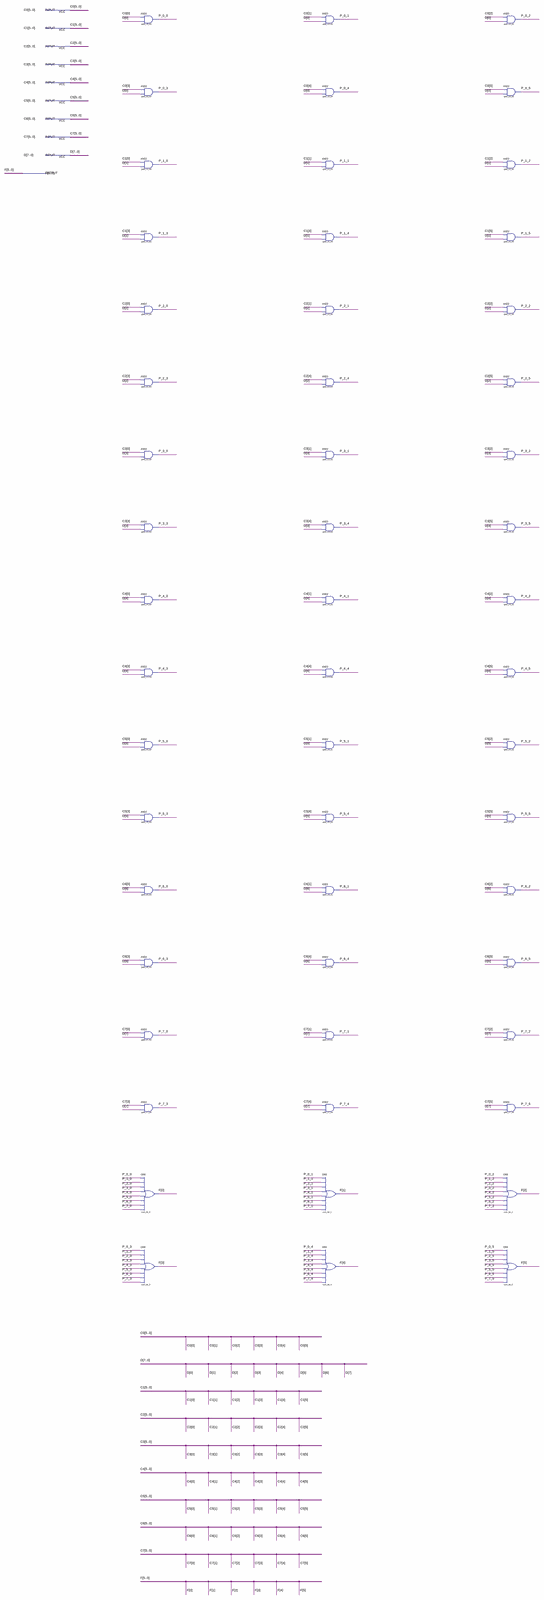
[diagram p0: schematic sheet, whole]
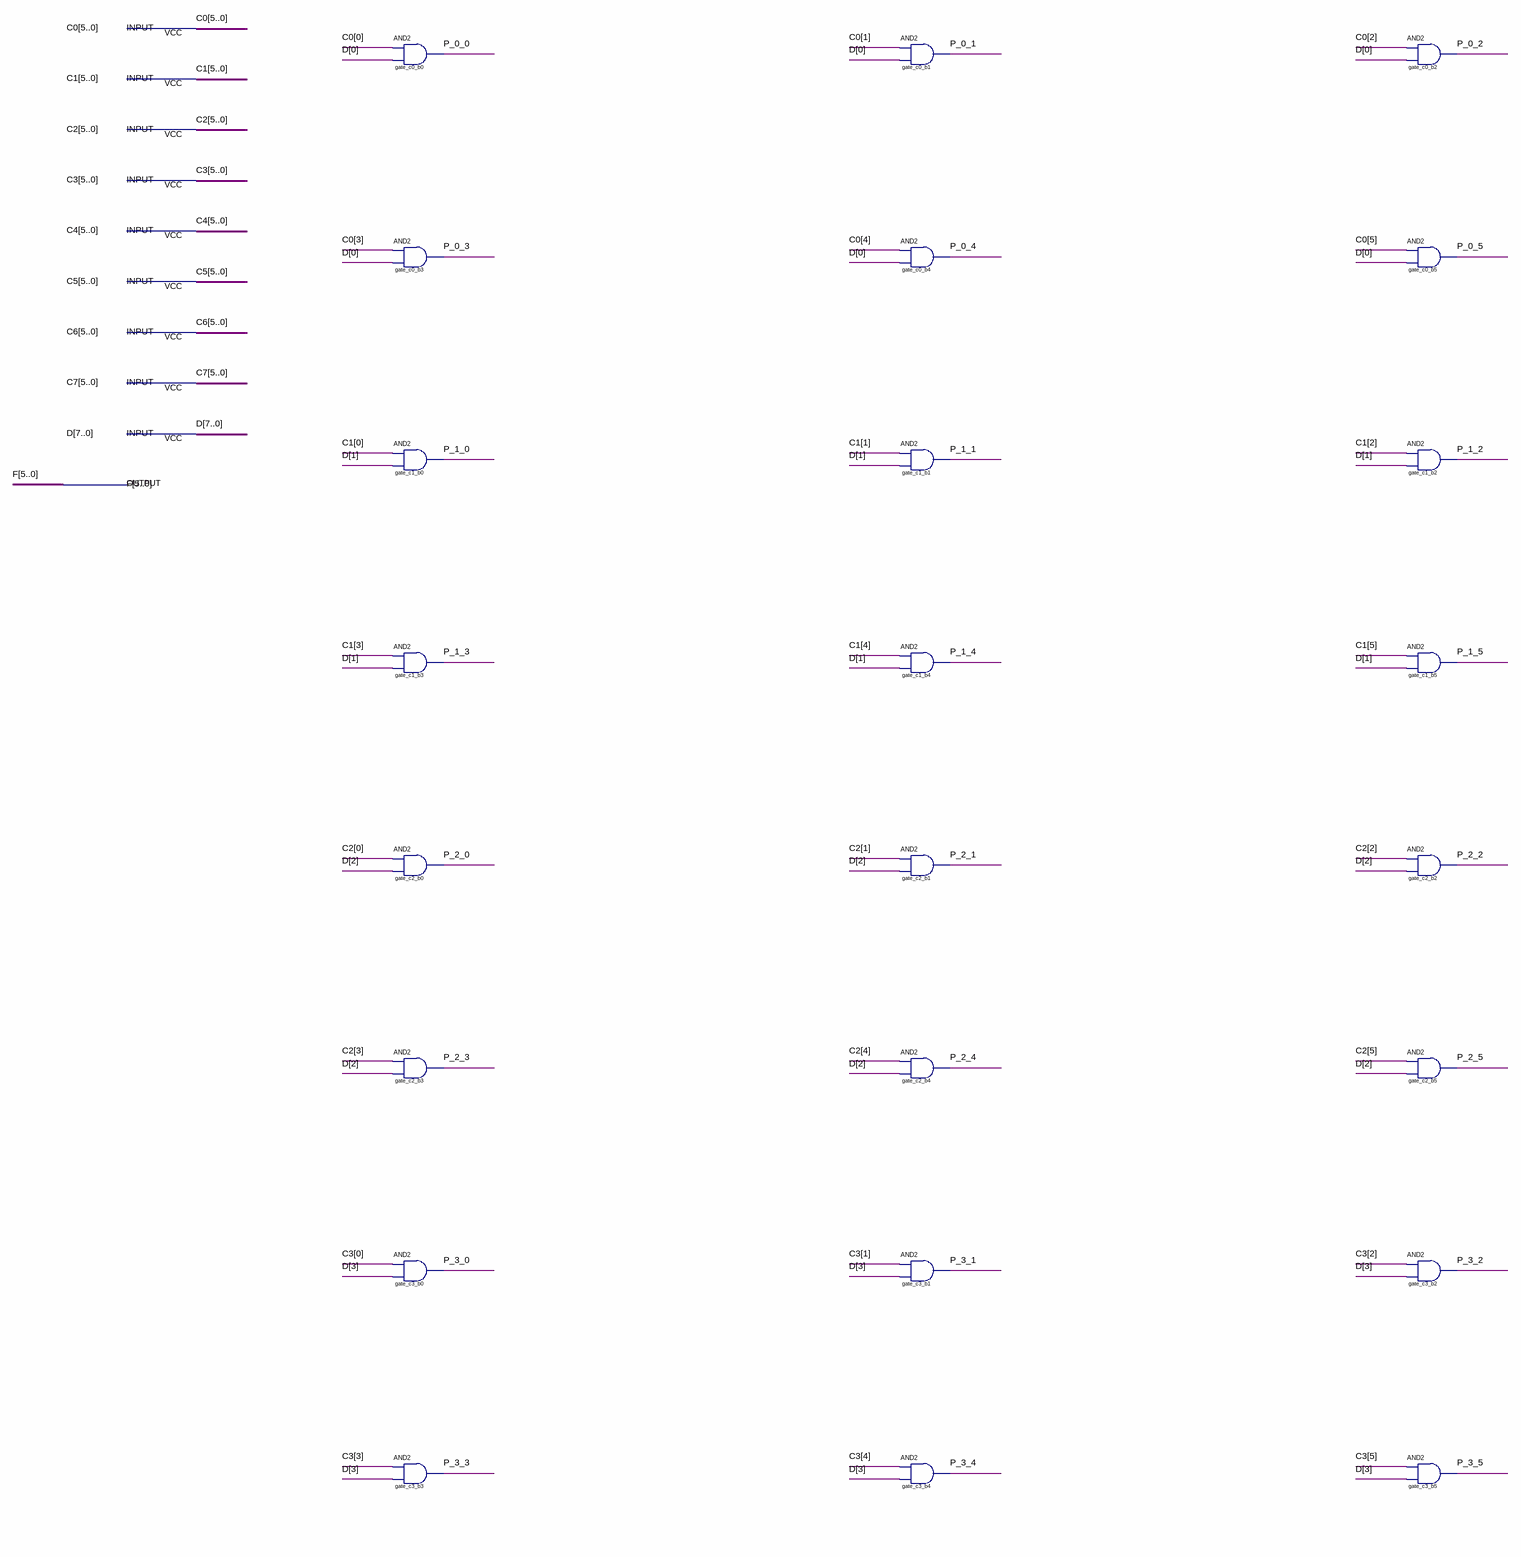
[diagram p1: schematic sheet, upper part]
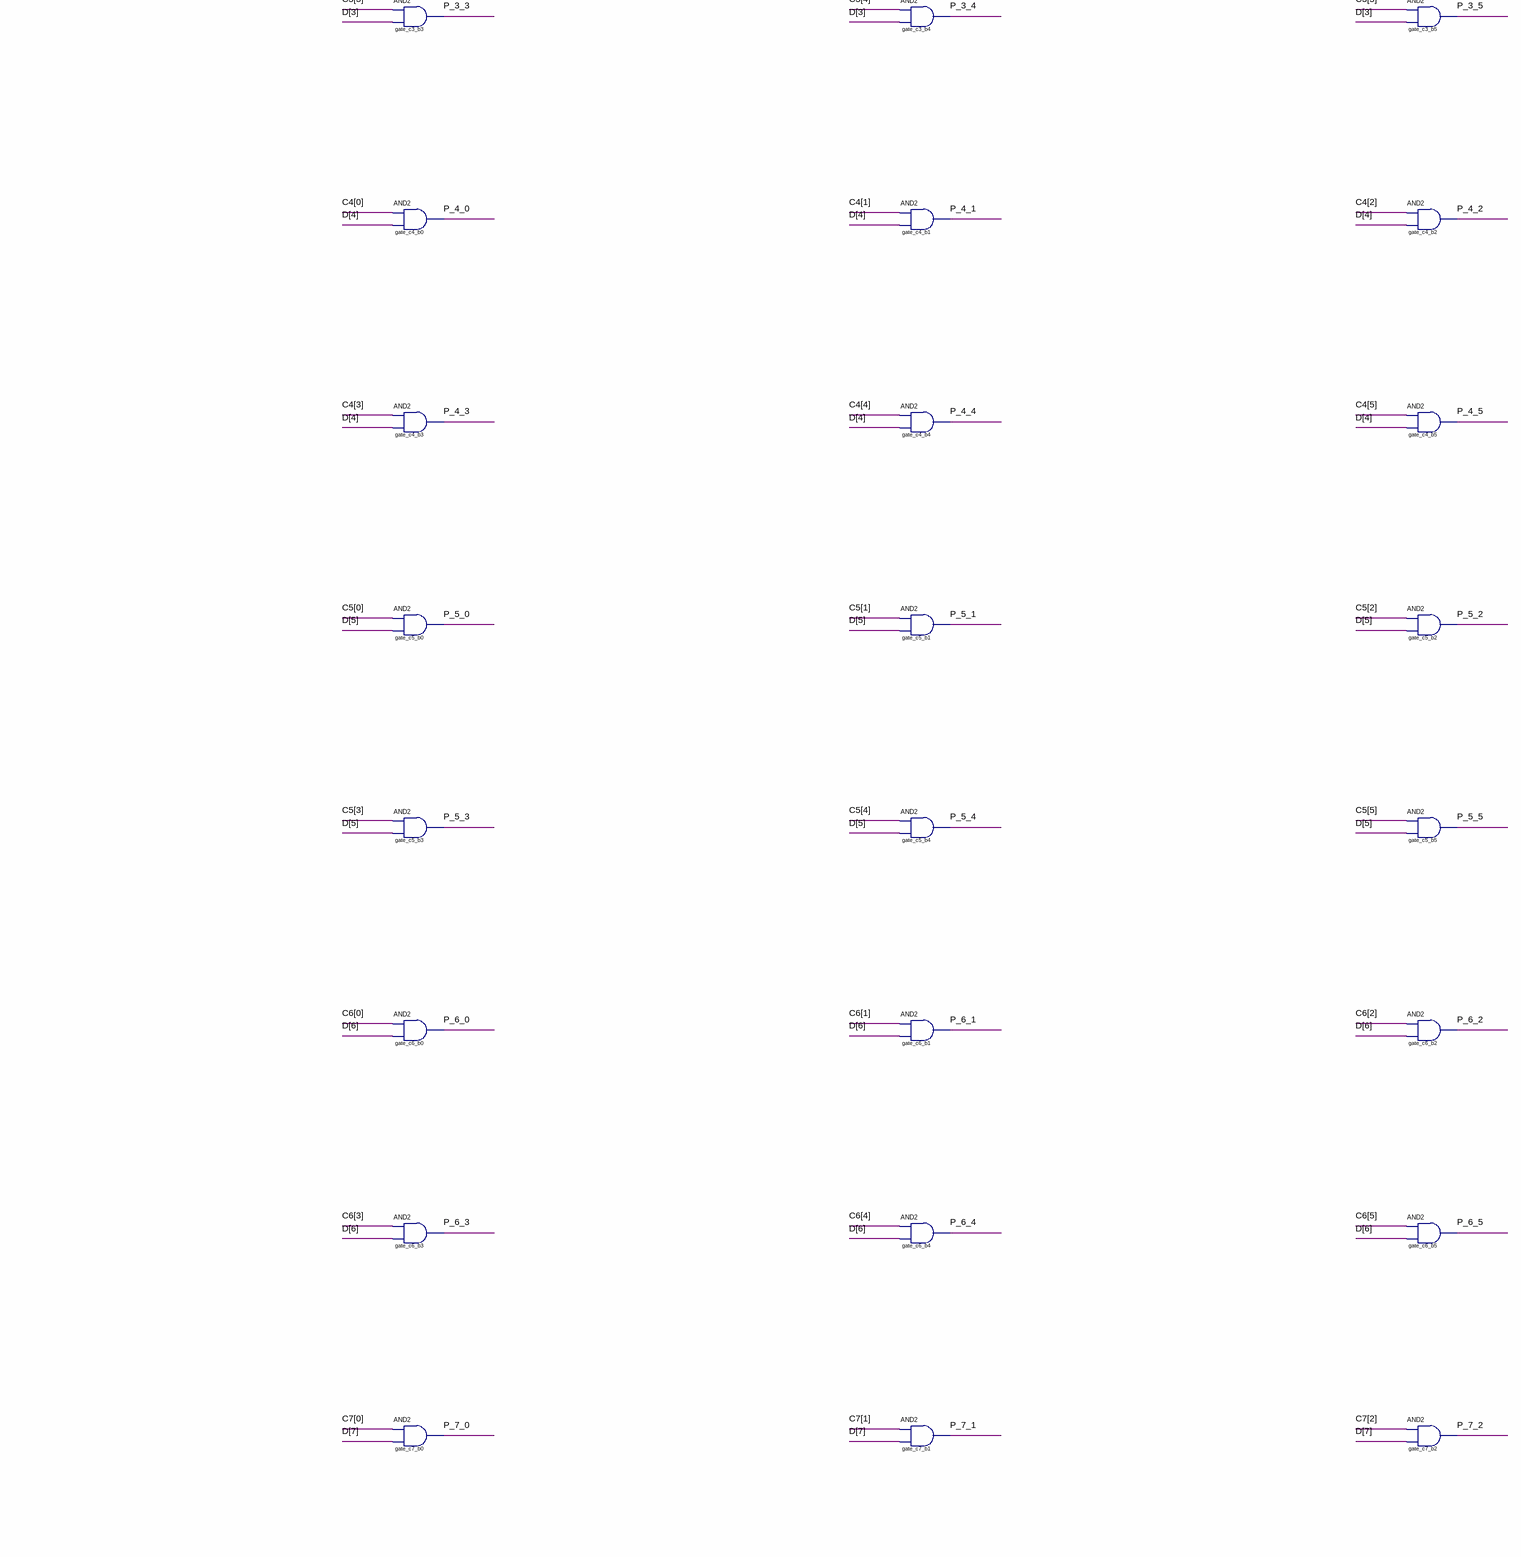
[diagram p2: schematic sheet, middle part]
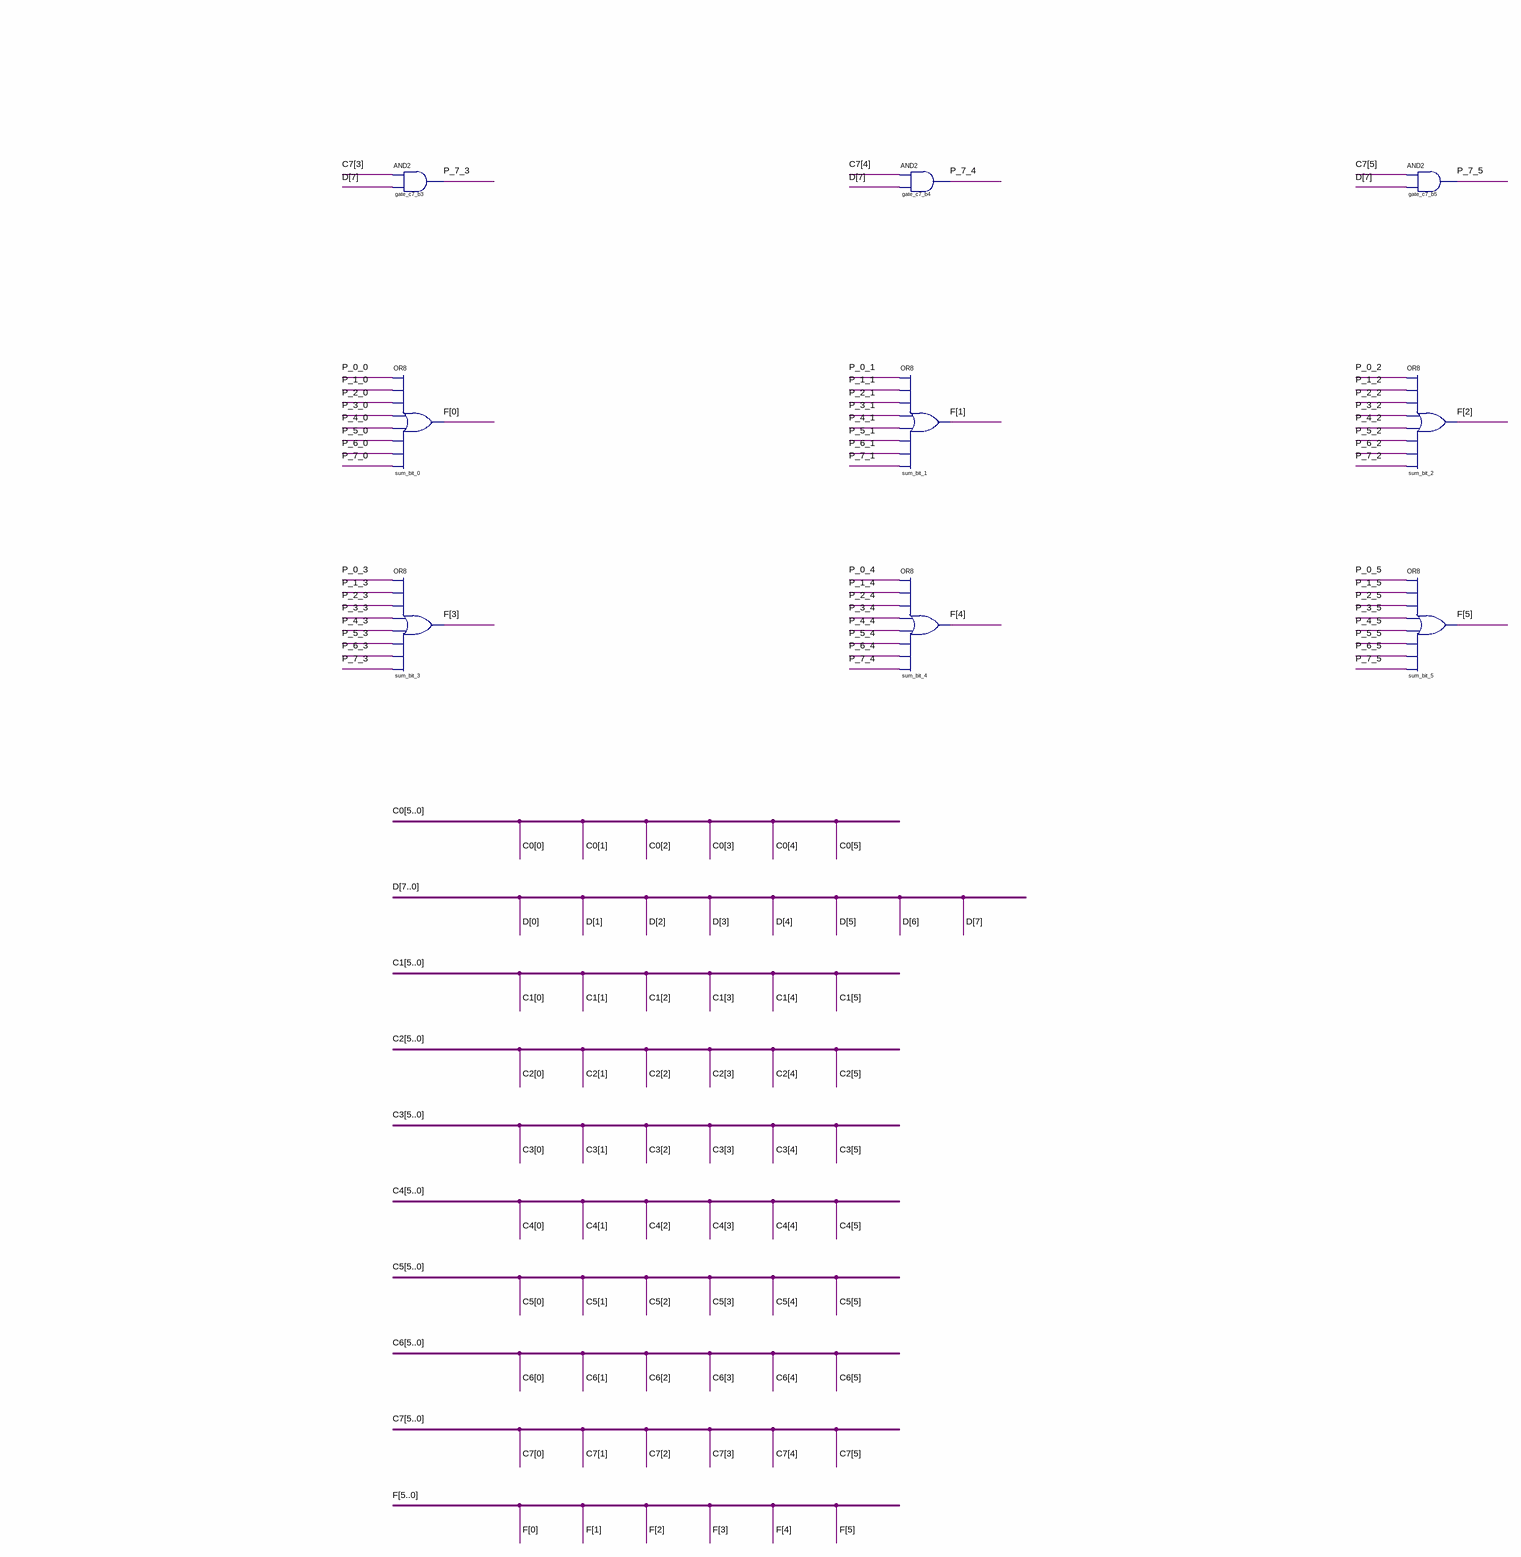
[diagram p3: schematic sheet, lower part]
// Quartus schematic mux_resultado_8x6.bdf as structural Verilog: 54 symbols, 10 pins
module mux_resultado_8x6 (
  input  [5:0] C0,
  input  [5:0] C1,
  input  [5:0] C2,
  input  [5:0] C3,
  input  [5:0] C4,
  input  [5:0] C5,
  input  [5:0] C6,
  input  [5:0] C7,
  input  [7:0] D,
  output [5:0] F
);

  wire P_0_0, P_0_1, P_0_2, P_0_3, P_0_4, P_0_5, P_1_0, P_1_1, P_1_2, P_1_3, P_1_4, P_1_5, P_2_0, P_2_1,
       P_2_2, P_2_3, P_2_4, P_2_5, P_3_0, P_3_1, P_3_2, P_3_3, P_3_4, P_3_5, P_4_0, P_4_1, P_4_2, P_4_3,
       P_4_4, P_4_5, P_5_0, P_5_1, P_5_2, P_5_3, P_5_4, P_5_5, P_6_0, P_6_1, P_6_2, P_6_3, P_6_4, P_6_5,
       P_7_0, P_7_1, P_7_2, P_7_3, P_7_4, P_7_5;

  and gate_c0_b0 (P_0_0, C0[0], D[0]);
  and gate_c0_b3 (P_0_3, C0[3], D[0]);
  and gate_c1_b0 (P_1_0, C1[0], D[1]);
  and gate_c1_b3 (P_1_3, C1[3], D[1]);
  and gate_c2_b0 (P_2_0, C2[0], D[2]);
  and gate_c2_b3 (P_2_3, C2[3], D[2]);
  and gate_c3_b0 (P_3_0, C3[0], D[3]);
  and gate_c3_b3 (P_3_3, C3[3], D[3]);
  and gate_c4_b0 (P_4_0, C4[0], D[4]);
  and gate_c4_b3 (P_4_3, C4[3], D[4]);
  and gate_c5_b0 (P_5_0, C5[0], D[5]);
  and gate_c5_b3 (P_5_3, C5[3], D[5]);
  and gate_c6_b0 (P_6_0, C6[0], D[6]);
  and gate_c6_b3 (P_6_3, C6[3], D[6]);
  and gate_c7_b0 (P_7_0, C7[0], D[7]);
  and gate_c7_b3 (P_7_3, C7[3], D[7]);
  or sum_bit_0 (F[0], P_0_0, P_1_0, P_2_0, P_3_0, P_4_0, P_5_0, P_6_0, P_7_0);
  or sum_bit_3 (F[3], P_0_3, P_1_3, P_2_3, P_3_3, P_4_3, P_5_3, P_6_3, P_7_3);
  and gate_c0_b1 (P_0_1, C0[1], D[0]);
  and gate_c0_b4 (P_0_4, C0[4], D[0]);
  and gate_c1_b1 (P_1_1, C1[1], D[1]);
  and gate_c1_b4 (P_1_4, C1[4], D[1]);
  and gate_c2_b1 (P_2_1, C2[1], D[2]);
  and gate_c2_b4 (P_2_4, C2[4], D[2]);
  and gate_c3_b1 (P_3_1, C3[1], D[3]);
  and gate_c3_b4 (P_3_4, C3[4], D[3]);
  and gate_c4_b1 (P_4_1, C4[1], D[4]);
  and gate_c4_b4 (P_4_4, C4[4], D[4]);
  and gate_c5_b1 (P_5_1, C5[1], D[5]);
  and gate_c5_b4 (P_5_4, C5[4], D[5]);
  and gate_c6_b1 (P_6_1, C6[1], D[6]);
  and gate_c6_b4 (P_6_4, C6[4], D[6]);
  and gate_c7_b1 (P_7_1, C7[1], D[7]);
  and gate_c7_b4 (P_7_4, C7[4], D[7]);
  or sum_bit_1 (F[1], P_0_1, P_1_1, P_2_1, P_3_1, P_4_1, P_5_1, P_6_1, P_7_1);
  or sum_bit_4 (F[4], P_0_4, P_1_4, P_2_4, P_3_4, P_4_4, P_5_4, P_6_4, P_7_4);
  and gate_c0_b2 (P_0_2, C0[2], D[0]);
  and gate_c0_b5 (P_0_5, C0[5], D[0]);
  and gate_c1_b2 (P_1_2, C1[2], D[1]);
  and gate_c1_b5 (P_1_5, C1[5], D[1]);
  and gate_c2_b2 (P_2_2, C2[2], D[2]);
  and gate_c2_b5 (P_2_5, C2[5], D[2]);
  and gate_c3_b2 (P_3_2, C3[2], D[3]);
  and gate_c3_b5 (P_3_5, C3[5], D[3]);
  and gate_c4_b2 (P_4_2, C4[2], D[4]);
  and gate_c4_b5 (P_4_5, C4[5], D[4]);
  and gate_c5_b2 (P_5_2, C5[2], D[5]);
  and gate_c5_b5 (P_5_5, C5[5], D[5]);
  and gate_c6_b2 (P_6_2, C6[2], D[6]);
  and gate_c6_b5 (P_6_5, C6[5], D[6]);
  and gate_c7_b2 (P_7_2, C7[2], D[7]);
  and gate_c7_b5 (P_7_5, C7[5], D[7]);
  or sum_bit_2 (F[2], P_0_2, P_1_2, P_2_2, P_3_2, P_4_2, P_5_2, P_6_2, P_7_2);
  or sum_bit_5 (F[5], P_0_5, P_1_5, P_2_5, P_3_5, P_4_5, P_5_5, P_6_5, P_7_5);
endmodule
